# EAGLE design RC_Transmitter_RX_FINAL_v4.4 (EAGLE 9.7.0)
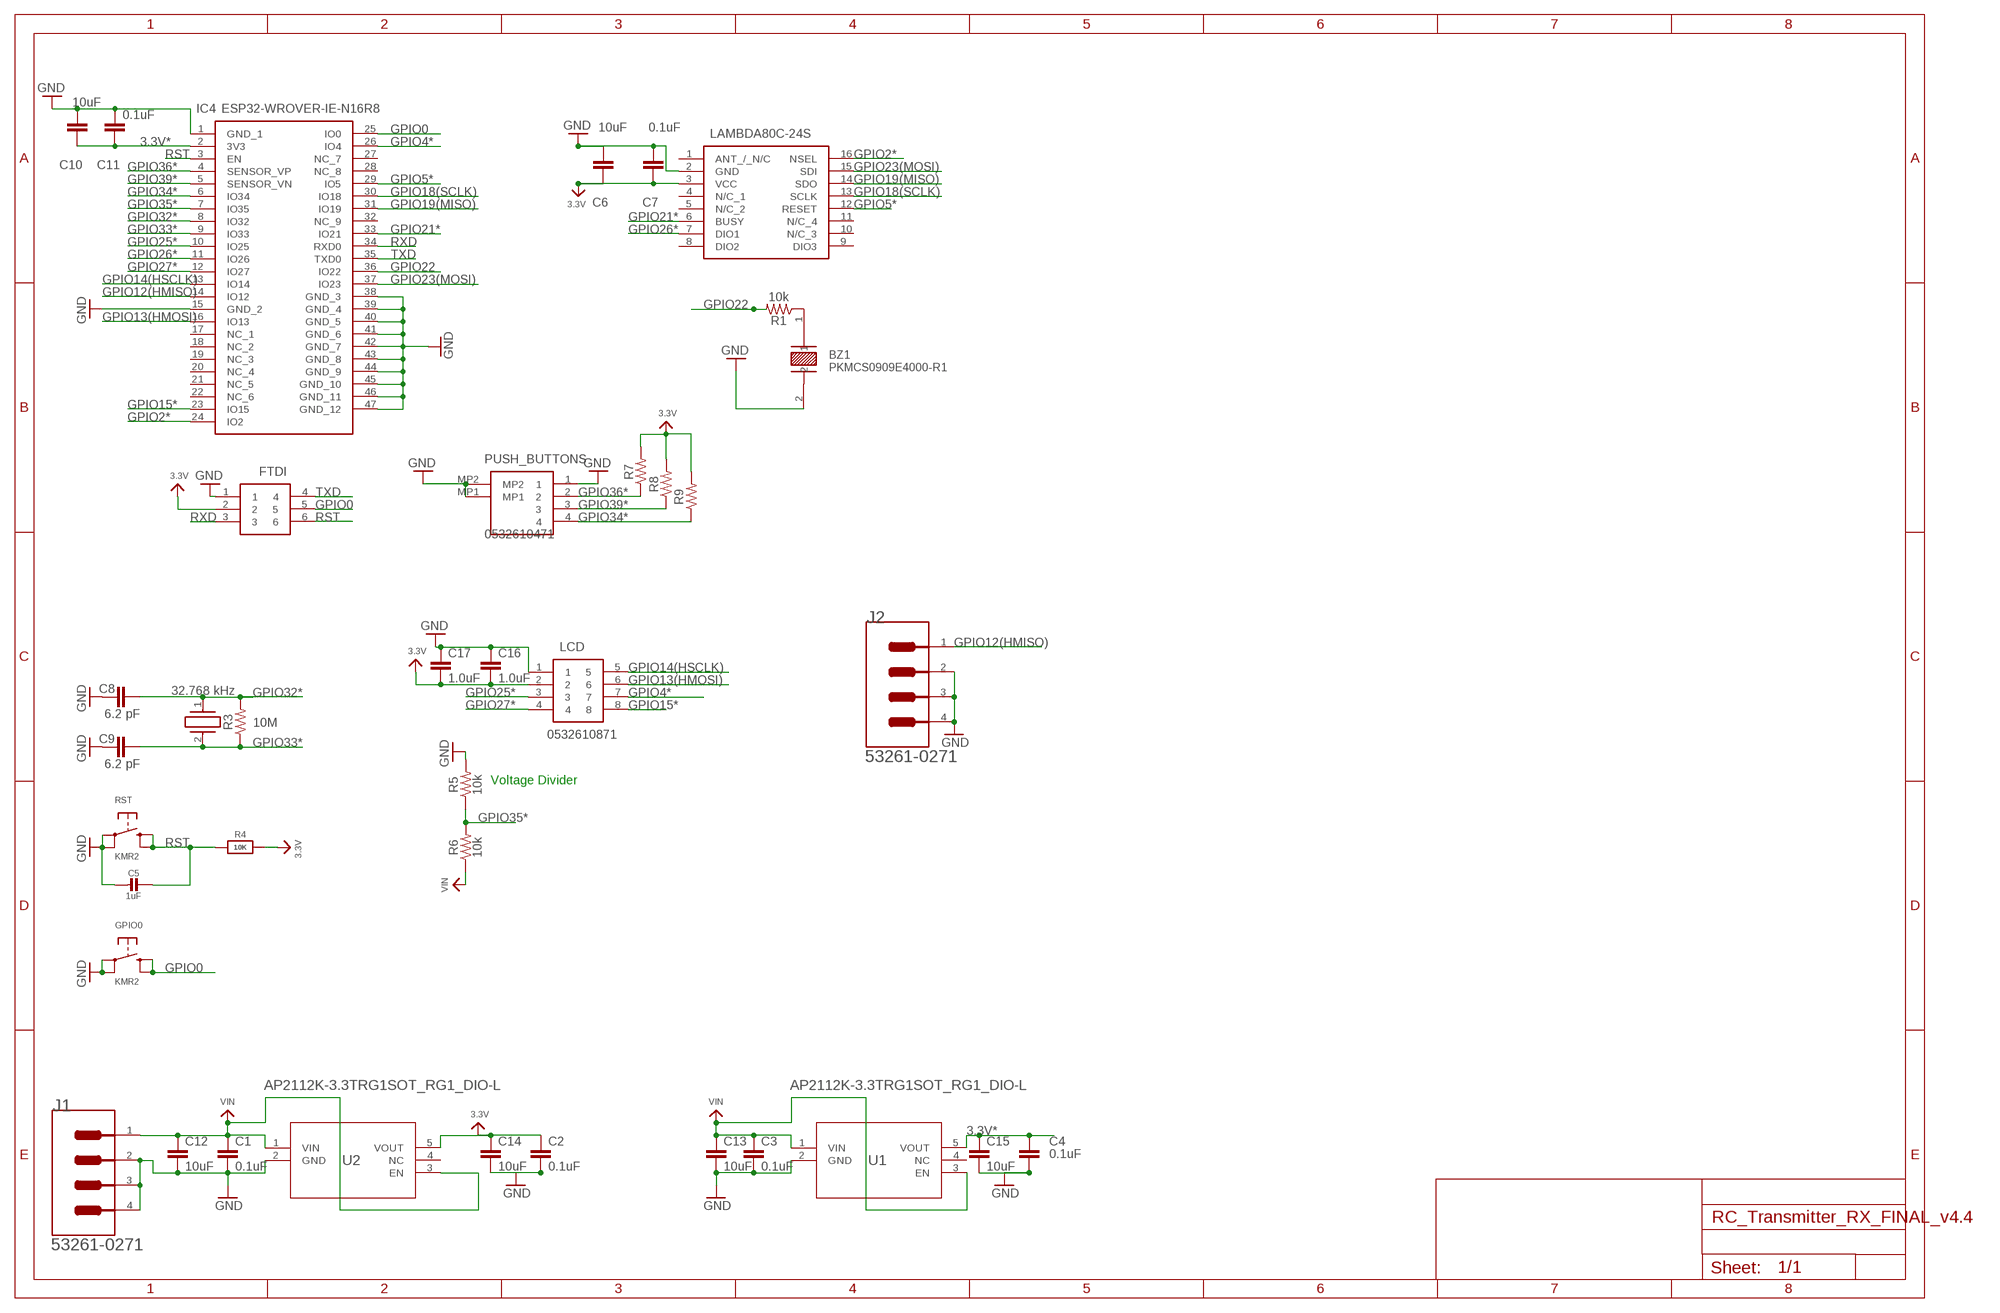
[diagram p0: schematic, sheet 1]

## Parts
BZ1  PKMCS0909E4000-R1  [PKMCS0909E4000-R1]
C1  0.1uF  10UF-0805-10V-10%  [0805]
C2  0.1uF  10UF-0805-10V-10%  [0805]
C3  0.1uF  10UF-0805-10V-10%  [0805]
C4  0.1uF  10UF-0805-10V-10%  [0805]
C5  1uF  CAP_CERAMIC0805-NOOUTLINE  [0805-NO]
C6  10uF  10UF-0805-10V-10%  [0805]
C7  0.1uF  10UF-0805-10V-10%  [0805]
C8  6.2 pF  C_CHIP-0805(2012-METRIC)  [CAPC2012X110]
C9  6.2 pF  C_CHIP-0805(2012-METRIC)  [CAPC2012X110]
C10  10uF  10UF-0805-10V-10%  [0805]
C11  0.1uF  10UF-0805-10V-10%  [0805]
C12  10uF  10UF-0805-10V-10%  [0805]
C13  10uF  10UF-0805-10V-10%  [0805]
C14  10uF  10UF-0805-10V-10%  [0805]
C15  10uF  10UF-0805-10V-10%  [0805]
C16  1.0uF  10UF-0805-10V-10%  [0805]
C17  1.0uF  10UF-0805-10V-10%  [0805]
CRYSTAL  32.768 kHz  ECX-.327-CDX-1293  [ECX327CDX1293]
FTDI  0532610671  [0532610671]
GPIO0  KMR2  SWITCH_TACT_SMT4.6X2.8  [BTN_KMR2_4.6X2.8]
IC1  LAMBDA80C-24S  [LAMBDA80C24S]
IC4  ESP32-WROVER-IE-N16R8  [ESP32WROVERIEN16R8]
J1  MOLEX_53261-0271MOLEX_53261-0271_0_0  [MOLEX_53261-0271_0]
J2  MOLEX_53261-0271MOLEX_53261-0271_0_0  [MOLEX_53261-0271_0]
LCD  0532610871  [53261-0871]
PUSH_BUTTONS  0532610471  [0532610471]
R1  10k  0OHM-0603-1/10W-5%  [0603]
R3  10M  0OHM-0603-1/10W-5%  [0603]
R4  10K  RESISTOR_0805  [_0805]
R5  10k  0OHM-0603-1/10W-5%  [0603]
R6  10k  0OHM-0603-1/10W-5%  [0603]
R7  0  0OHM-0603-1/10W-5%  [0603]
R8  0  0OHM-0603-1/10W-5%  [0603]
R9  0  0OHM-0603-1/10W-5%  [0603]
RST  KMR2  SWITCH_TACT_SMT4.6X2.8  [BTN_KMR2_4.6X2.8]
U1  AP2112K-3.3TRG1SOT_RG1_DIO-L  [SOT_RG1_DIO-L]
U2  AP2112K-3.3TRG1SOT_RG1_DIO-L  [SOT_RG1_DIO-L]

## Nets
3.3V: C2.1 C6.1 C7.1 C14.1 C16.2 C17.2 FTDI.2 IC1.3(VCC) LCD.2 R4.2 R7.2 R8.2 R9.2 U2.5(VOUT)
3.3V*: C4.1 C10.1 C11.1 C15.1 IC4.2(3V3) U1.5(VOUT)
GND: BZ1.2 C1.2 C2.2 C3.2 C4.2 C5.2 C6.2 C7.2 C8.1 C9.1 C10.2 C11.2 C12.2 C13.2 C14.2 C15.2 C16.1 C17.1 FTDI.1 GPIO0.A'(P1) GPIO0.A(P) IC1.2(GND) IC4.1(GND_1) IC4.15(GND_2) IC4.38(GND_3) IC4.39(GND_4) IC4.40(GND_5) IC4.41(GND_6) IC4.42(GND_7) IC4.43(GND_8) IC4.44(GND_9) IC4.45(GND_10) IC4.46(GND_11) IC4.47(GND_12) J1.2 J1.3(MNT_1) J1.4(MNT_2) J2.2 J2.3(MNT_1) J2.4(MNT_2) LCD.1 PUSH_BUTTONS.1 PUSH_BUTTONS.MP1 PUSH_BUTTONS.MP2 R5.2 RST.A'(P1) RST.A(P) U1.2(GND) U2.2(GND)
GPIO0: FTDI.5 GPIO0.B'(S1) GPIO0.B(S) IC4.25(IO0)
GPIO2*: IC1.16(NSEL) IC4.24(IO2)
GPIO4*: IC4.26(IO4) LCD.7
GPIO5*: IC1.12(RESET) IC4.29(IO5)
GPIO12(HMISO): IC4.14(IO12) J2.1
GPIO13(HMOSI): IC4.16(IO13) LCD.6
GPIO14(HSCLK): IC4.13(IO14) LCD.5
GPIO15*: IC4.23(IO15) LCD.8
GPIO18(SCLK): IC1.13(SCLK) IC4.30(IO18)
GPIO19(MISO): IC1.14(SDO) IC4.31(IO19)
GPIO21*: IC1.6(BUSY) IC4.33(IO21)
GPIO22: IC4.36(IO22) R1.2
GPIO23(MOSI): IC1.15(SDI) IC4.37(IO23)
GPIO25*: IC4.10(IO25) LCD.3
GPIO26*: IC1.7(DIO1) IC4.11(IO26)
GPIO27*: IC4.12(IO27) LCD.4
GPIO32*: C8.2 CRYSTAL.1(X1) IC4.8(IO32) R3.2
GPIO33*: C9.2 CRYSTAL.2(X2) IC4.9(IO33) R3.1
GPIO34*: IC4.6(IO34) PUSH_BUTTONS.4 R9.1
GPIO35*: IC4.7(IO35) R5.1 R6.2
GPIO36*: IC4.4(SENSOR_VP) PUSH_BUTTONS.2 R7.1
GPIO39*: IC4.5(SENSOR_VN) PUSH_BUTTONS.3 R8.1
N$1: BZ1.1 R1.1
RST: C5.1 FTDI.6 IC4.3(EN) R4.1 RST.B'(S1) RST.B(S)
RXD: FTDI.3 IC4.34(RXD0)
TXD: FTDI.4 IC4.35(TXD0)
VIN: C1.1 C3.1 C12.1 C13.1 J1.1 R6.1 U1.1(VIN) U1.3(EN) U2.1(VIN) U2.3(EN)
Unconnected: IC1.1(ANT_/_N/C) IC1.4(N/C_1) IC1.5(N/C_2) IC1.8(DIO2) IC1.9(DIO3) IC1.10(N/C_3) IC1.11(N/C_4) IC4.17(NC_1) IC4.18(NC_2) IC4.19(NC_3) IC4.20(NC_4) IC4.21(NC_5) IC4.22(NC_6) IC4.27(NC_7) IC4.28(NC_8) IC4.32(NC_9) U1.4(NC) U2.4(NC)

## Notes on the sheet
- Voltage Divider

## Library data of the parts
BZ1 = Microphone:PKMCS0909E4000-R1: AUDIO PIEZO TRANSDUCER 12.5V SMD Manufacturer's datasheet <https://www.murata.com/~/media/webrenewal/products/sound/sounder/vppt-buzj083-d.ashx>; CREATED_BY: PCBLayout.com; DIGIKEY_PARTNO: 490-9647-2-ND; MANUFACTURER: Murata Electronics; MPN: PKMCS0909E4000-R1
C1-C4 C7 C11 C16 C17 = SparkFun-Capacitors:10UF: 10.0µF ceramic capacitors A capacitor is a passive two-terminal electrical component used to store electrical energy temporarily in an electric field.; PROD_ID: CAP-11330; VALUE: 10uF
C5 = microbuilder:CAP_CERAMIC: Ceramic Capacitors For new designs, use the packages preceded by an '_' character since they are more reliable: The following footprints should be used on most boards: _0402 - Standard footprint for regular board layouts _0603 - Standard footprint for regular board layouts _0805 - Standard footprint for regular board layouts _1206 - Standard footprint for regular board layouts For extremely tight-pitch boards where space is at a premium, the following 'micro-pitch' footprints can be used (smaller pads, no silkscreen outline, etc.): _0402MP - Micro-pitch footprint for very dense/compact boards _0603MP - Micro-pitch footprint for very dense/compact boards _0805MP - Micro-pitch footprint for very dense/compact boards _1206MP - Micro-pitch footprint for very dense/compact boards
C6 C10 C12-C15 = SparkFun-Capacitors:10UF: 10.0µF ceramic capacitors A capacitor is a passive two-terminal electrical component used to store electrical energy temporarily in an electric field.; PROD_ID: CAP-11330
C8 C9 = Capacitor:C: Capacitor - Generic; CATEGORY: Capacitor
CRYSTAL = ECX-.327-CDX-1293:ECX-.327-CDX-1293: Crystals 32.786kHz 12.5pF 5ppm -40C +85C Source: Datasheet <https://www.ecsxtal.com/store/pdf/ECS-.327-CDX-1293.pdf>; ARROW_PART_NUMBER: Crystal; ARROW_PRICE-STOCK: https://www.arrow.com/en/products/ecx-.327-cdx-1293/ecs-international?region=nac; DESCRIPTION: Crystals 32.786kHz 12.5pF 5ppm -40C +85C; HEIGHT: 0.9mm; MANUFACTURER_NAME: ECS; MANUFACTURER_PART_NUMBER: ECX-.327-CDX-1293; MOUSER_PART_NUMBER: 520-ECX-.327CDX-1293; MOUSER_PRICE-STOCK: https://www.mouser.co.uk/ProductDetail/ECS/ECX-.327-CDX-1293?qs=Mv7BduZupUhhIpiFqP8JVA%3D%3D
FTDI = 0532610671:0532610671: 1.25mm Pitch PicoBlade Header, Surface Mount, Right Angle, 6 Circuits Source: Datasheet <http://www.molex.com/webdocs/datasheets/pdf/en-us//0532610671_PCB_HEADERS.pdf>; ARROW_PART_NUMBER: 0532610671; ARROW_PRICE-STOCK: https://www.arrow.com/en/products/0532610671/molex?region=europe; DESCRIPTION: 1.25mm Pitch PicoBlade Header, Surface Mount, Right Angle, 6 Circuits; HEIGHT: mm; MANUFACTURER_NAME: Molex; MANUFACTURER_PART_NUMBER: 0532610671; MOUSER_PART_NUMBER: N/A; MOUSER_PRICE-STOCK: https://www.mouser.co.uk/ProductDetail/Molex/0532610671?qs=PBcRNPEHKspfA5Wux0sJoA%3D%3D
GPIO0 RST = microbuilder:SWITCH_TACT_SMT: SMT Tact Switches 6x6mm - Digikey: P12940SCT-ND KMR2 (4.6x2.8mm) - Digikey: 401-1426-1-ND EVQ-PQHB55 - Light Touch, 160GF (4.5x4.5mm) - Digikey: P8090SCT-ND KMT0 - KMT021 NGJ LHS (etc.) IP68/Waterproof - Digikey: CKN10289CT-ND
IC1 = LAMBDA80C-24S:LAMBDA80C-24S: RF Transceiver FSK 3.3V 16-Pin SMD Module Source: Datasheet <https://www.arrow.com/en/products/lambda80c-24s/rf-solutions>; ARROW_PART_NUMBER: LAMBDA80C-24S; ARROW_PRICE-STOCK: https://www.arrow.com/en/products/lambda80c-24s/rf-solutions; DESCRIPTION: RF Transceiver FSK 3.3V 16-Pin SMD Module; HEIGHT: 2mm; MANUFACTURER_NAME: RF SOLUTIONS; MANUFACTURER_PART_NUMBER: LAMBDA80C-24S; MOUSER_PART_NUMBER: 223-LAMBDA80C-24S; MOUSER_PRICE-STOCK: https://www.mouser.co.uk/ProductDetail/RF-Solutions/LAMBDA80C-24S?qs=17u8i%2FzlE89dhjIrlJ9FHg%3D%3D
IC4 = ESP32-Wrover-IE-N16R8:ESP32-WROVER-IE-N16R8: RX TXRX MOD WIFI EXT IPEX SMD Source: Datasheet <https://www.espressif.com/sites/default/files/documentation/esp32-wrover-e_esp32-wrover-ie_datasheet_en.pdf>; DESCRIPTION: RX TXRX MOD WIFI EXT IPEX SMD; HEIGHT: 3.45mm; MANUFACTURER_NAME: Espressif Systems; MANUFACTURER_PART_NUMBER: ESP32-Wrover-IE-N16R8; MOUSER_PART_NUMBER: 356-ESP32WRVIE2864UC; MOUSER_PRICE-STOCK: https://www.mouser.co.uk/ProductDetail/Espressif-Systems/ESP32-WROVER-IE-N16R8?qs=Li%252BoUPsLEnvfUqsrs3zskw%3D%3D
J1 J2 = Molex - 53261-0271:MOLEX_53261-0271: Headers & Wire Housings 1.25MM HDR 2 CKT Right-Angle; CENTROID_NOT_SPECIFIED: No; DATASHEET: http://www.molex.com/pdm_docs/sd/532610271_sd.pdf; DIGIKEY_DESCRIPTION: CONN HEADER 2POS 1.25MM R/A SMD; DIGIKEY_PART_NUMBER: WM7620CT-ND; LEAD_FREE: yes; MF: Molex; MOUSER_PART_NUMBER: 538-53261-0271; MPN: 53261-0271; PACKAGE: HDR02; PREFIX: J; ROHS: yes; TEMPERATURE_RANGE_HIGH: +85°C; TEMPERATURE_RANGE_LOW: -40°C
LCD = 0532610871:0532610871: CONN HEADER 8POS 1.25MM R/A SMD Source: Datasheet <https://www.molex.com/pdm_docs/sd/532610871_sd.pdf>; ARROW_PART_NUMBER: 0532610871; ARROW_PRICE-STOCK: https://www.arrow.com/en/products/0532610871/molex?region=europe; DESCRIPTION: CONN HEADER 8POS 1.25MM R/A SMD; HEIGHT: mm; MANUFACTURER_NAME: Molex; MANUFACTURER_PART_NUMBER: 0532610871; MOUSER_PART_NUMBER: N/A; MOUSER_PRICE-STOCK: https://www.mouser.co.uk/ProductDetail/Molex/0532610871?qs=PBcRNPEHKspgmg1Yw%252BK1hQ%3D%3D
PUSH_BUTTONS = 0532610471:0532610471: Headers & Wire Housings 1.25MM HDR 04P RA SMT Source: Datasheet <https://www.molex.com/pdm_docs/sd/532610471_sd.pdf>; ARROW_PART_NUMBER: 0532610471; ARROW_PRICE-STOCK: https://www.arrow.com/en/products/0532610471/molex?region=nac; DESCRIPTION: Headers & Wire Housings 1.25MM HDR 04P RA SMT; HEIGHT: 3.6mm; MANUFACTURER_NAME: Molex; MANUFACTURER_PART_NUMBER: 0532610471; MOUSER_PART_NUMBER: N/A; MOUSER_PRICE-STOCK: https://www.mouser.co.uk/ProductDetail/Molex/0532610471?qs=PBcRNPEHKsrtKT62ep6ONg%3D%3D
R1 R3 R5 R6 = SparkFun-Resistors:0OHM: 0Ω resistor A resistor is a passive two-terminal electrical component that implements electrical resistance as a circuit element. Resistors act to reduce current flow, and, at the same time, act to lower voltage levels within circuits. - Wikipedia; PROD_ID: RES-08609; VALUE: 0
R4 = microbuilder:RESISTOR: Resistors For new designs, use the packages preceded by an '_' character since they are more reliable: The following footprints should be used on most boards: _0402 - Standard footprint for regular board layouts _0603 - Standard footprint for regular board layouts _0805 - Standard footprint for regular board layouts _1206 - Standard footprint for regular board layouts For extremely tight-pitch boards where space is at a premium, the following 'micro-pitch' footprints can be used (smaller pads, no silkscreen outline, etc.): _0402MP - Micro-pitch footprint for very dense/compact boards _0603MP - Micro-pitch footprint for very dense/compact boards _0805MP - Micro-pitch footprint for very dense/compact boards _1206MP - Micro-pitch footprint for very dense/compact boards
R7-R9 = SparkFun-Resistors:0OHM: 0Ω resistor A resistor is a passive two-terminal electrical component that implements electrical resistance as a circuit element. Resistors act to reduce current flow, and, at the same time, act to lower voltage levels within circuits. - Wikipedia; PROD_ID: RES-08609
U1 U2 = 2023-03-07_19-05-44_Library:AP2112K-3.3TRG1; COPYRIGHT: Copyright (C) 2023 Ultra Librarian. All rights reserved.; MANUFACTURER_PART_NUMBER: AP2112K-3.3TRG1; MFR_NAME: Diodes Inc

## Board
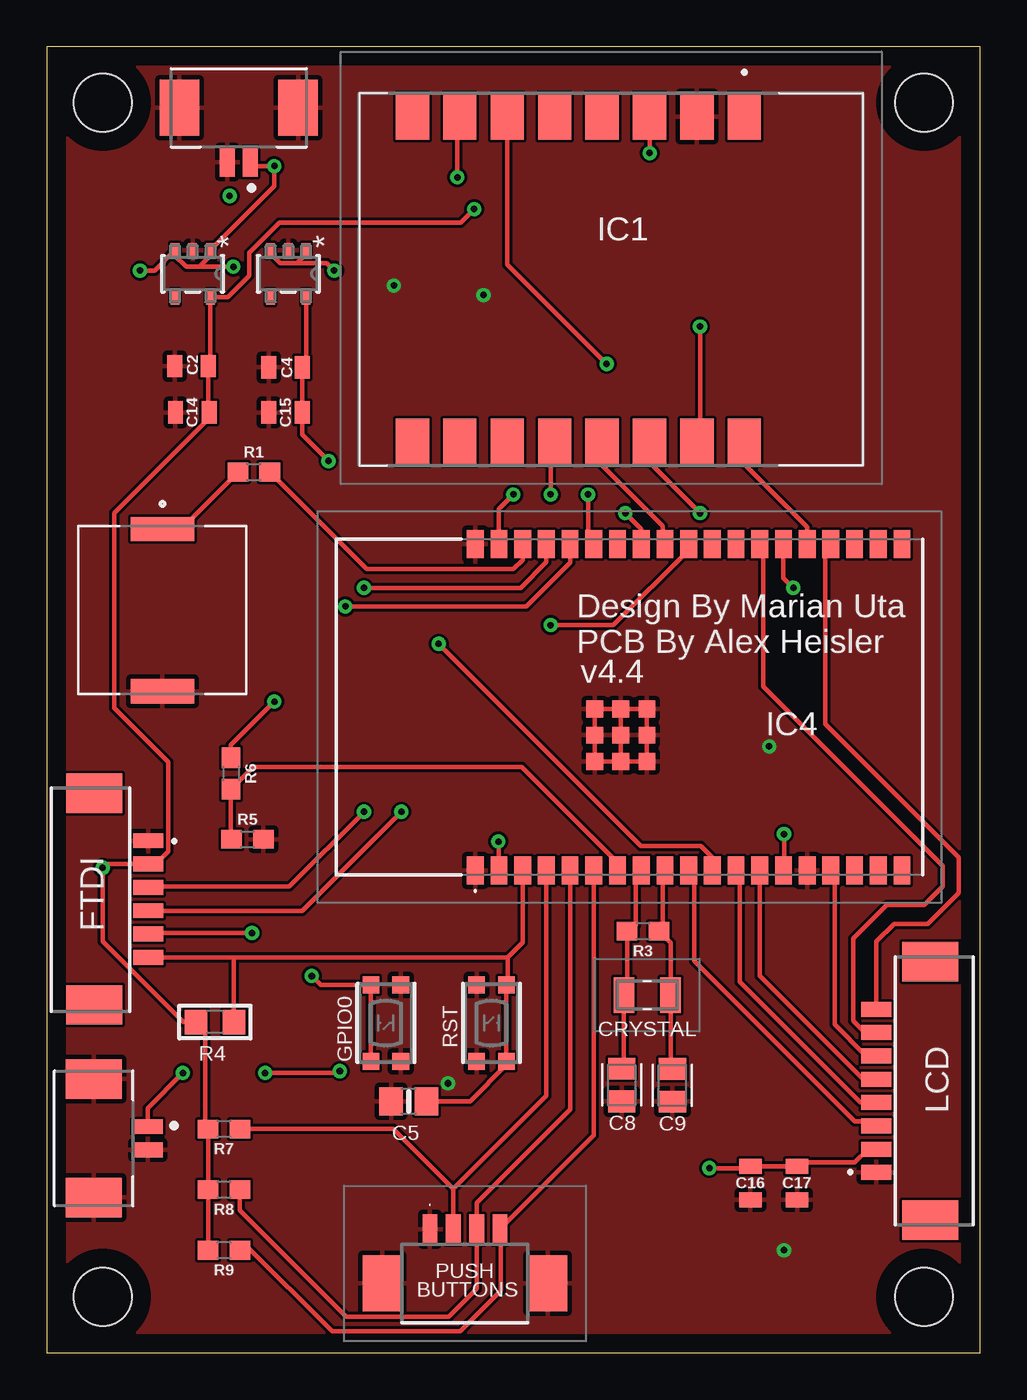
[diagram p1: board, top side]
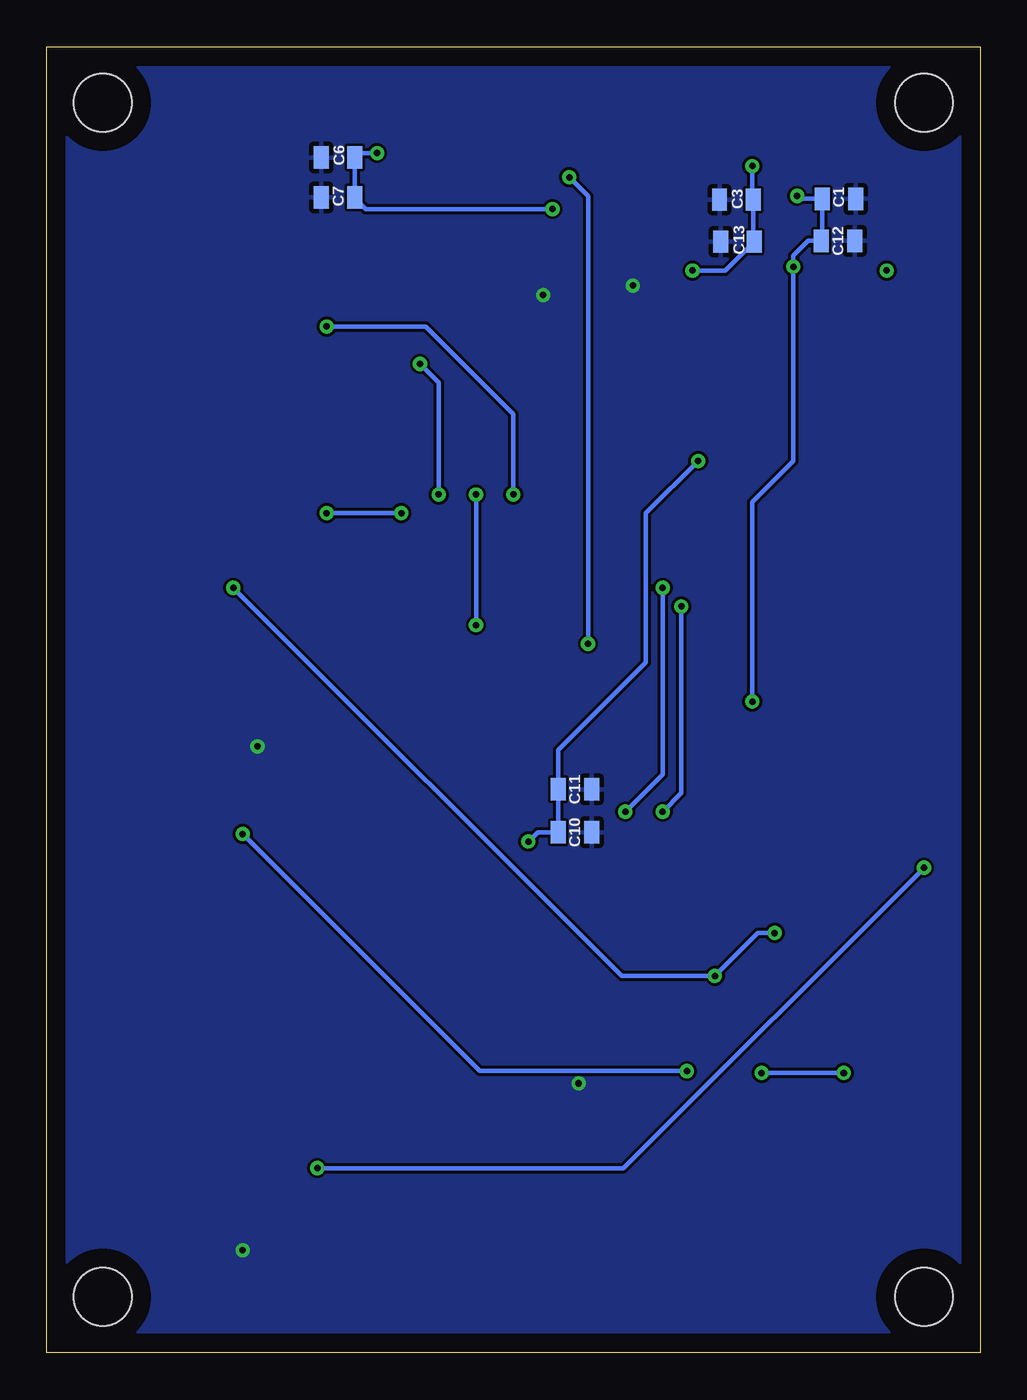
[diagram p2: board, bottom side, seen from below]

Size 50 x 70 mm. Coordinates in mm from the lower left corner, seen from the top.
Outline: 0,0 50,0 50,70 0,70 0,0
Copper layers (1*16): Top 0.035mm / dielectric 1.5mm / Bottom 0.035mm
Design rules "default": minimum track width 6mil, minimum drill 0.35mm, track to track 6mil, track to pad 6mil, pad to pad 6mil, via to via 6mil, smd to smd 6mil, copper to edge 40mil, drill to drill 6mil, minimum pad ring 10mil, minimum via ring 8mil, stop-mask expansion 4mil, vias tented up to drill 0mil, thermal gap 10mil
Holes 3.1 mm at 3,3 47,3 47,67 3,67

### Footprints (pad centres in the part's own frame; a part is rotated, then mirrored left to right if it is on the bottom)
PKMCS0909E4000-R1 = smd 1.3 x 3.4: 1 -4.35,0; 2 4.35,0
0805 = smd 0.8 x 1.2: 1 -0.9,0; 2 0.9,0
0805-NO = smd 1.24 x 1.5: 1 -0.95,0; 2 0.95,0
CAPC2012X110 = smd 1.165 x 1.465: 1 -0.875,0; 2 0.875,0
ECX327CDX1293 = smd 1.1 x 1.9: 1 -1.25,0; 2 1.25,0
0532610671 = smd 0.8 x 1.6: 1 -3.125,1.004; 2 -1.875,1.004; 3 -0.625,1.004; 4 0.625,1.004; 5 1.875,1.004; 6 3.125,1.004 | smd 2.1 x 3: 7 -5.675,-1.896; 8 5.675,-1.896
BTN_KMR2_4.6X2.8 = smd 0.9 x 0.9: A 2.05,0.8; A' -2.05,0.8; B 2.05,-0.8; B' -2.05,-0.8
LAMBDA80C24S = smd 2.5 x 1.78: 1 -8.725,7.135; 2 -8.725,4.595; 3 -8.725,2.055; 4 -8.725,-0.485; 5 -8.725,-3.025; 6 -8.725,-5.565; 7 -8.725,-8.105; 8 -8.725,-10.645; 9 8.725,-10.645; 10 8.725,-8.105; 11 8.725,-5.565; 12 8.725,-3.025; 13 8.725,-0.485; 14 8.725,2.055; 15 8.725,4.595; 16 8.725,7.135
ESP32WROVERIEN16R8 = smd 1.5 x 0.9: 1 -8.75,8.26; 2 -8.75,6.99; 3 -8.75,5.72; 4 -8.75,4.45; 5 -8.75,3.18; 6 -8.75,1.91; 7 -8.75,0.64; 8 -8.75,-0.63; 9 -8.75,-1.9; 10 -8.75,-3.17; 11 -8.75,-4.44; 12 -8.75,-5.71; 13 -8.75,-6.98; 14 -8.75,-8.25; 15 -8.75,-9.52; 16 -8.75,-10.79; 17 -8.75,-12.06; 18 -8.75,-13.33; 19 -8.75,-14.6; 20 8.75,-14.6; 21 8.75,-13.33; 22 8.75,-12.06; 23 8.75,-10.79; 24 8.75,-9.52; 25 8.75,-8.25; 26 8.75,-6.98; 27 8.75,-5.71; 28 8.75,-4.44; 29 8.75,-3.17; 30 8.75,-1.9; 31 8.75,-0.63; 32 8.75,0.64; 33 8.75,1.91; 34 8.75,3.18; 35 8.75,4.45; 36 8.75,5.72; 37 8.75,6.99; 38 8.75,8.26 | smd 0.9 x 0.9: 39 -1.5,0.46; 40 -1.5,1.86; 41 -2.9,1.86; 42 -2.9,0.46; 43 -2.9,-0.94; 44 -1.5,-0.94; 45 -0.1,-0.94; 46 -0.1,0.46; 47 -0.1,1.86
MOLEX_53261-0271_0 = smd 0.8 x 1.6: 1 -0.625,2.9; 2 0.625,2.9 | smd 2.1 x 3: 3 -3.175,0; 4 3.175,0
53261-0871 = smd 0.8 x 1.6: 1 -4.375,1.004; 2 -3.125,1.004; 3 -1.875,1.004; 4 -0.625,1.004; 5 0.625,1.004; 6 1.875,1.004; 7 3.125,1.004; 8 4.375,1.004 | smd 2.1 x 3: 9 6.925,-1.896; 10 -6.925,-1.896
0532610471 = smd 0.8 x 1.6: 1 -1.875,0.8; 2 -0.625,0.8; 3 0.625,0.8; 4 1.875,0.8 | smd 2.1 x 3: MP1 4.425,-2.1; MP2 -4.425,-2.1
0603 = smd 1.1 x 1: 1 -0.85,0; 2 0.85,0
_0805 = smd 1.2 x 1.3: 1 -1.016,0; 2 1.016,0
SOT_RG1_DIO-L = smd 0.8 x 0.457: 1 -1.251,0.95; 2 -1.251,0; 3 -1.251,-0.95; 4 1.251,-0.95; 5 1.251,0.95

### Placement (x,y rotation side)
BZ1  6.2,39.8 270 top
C1  7.54,61.84 0 bottom
C2  7.76,52.88 180 top
C3  13.05,61.8 180 bottom
C4  12.8,52.82 180 top
C5  19.4,13.48 180 top
C6  34.39,64.06 180 bottom
C7  34.4,61.92 180 bottom
C8  30.8,14.35 90 top
C9  33.52,14.35 90 top
C10  21.7,27.9 0 bottom
C11  21.7,30.2 0 bottom
C12  7.6,59.6 0 bottom
C13  13,59.55 180 bottom
C14  7.8,50.4 180 top
C15  12.8,50.4 180 top
C16  37.7,9.1 90 top
C17  40.2,9.1 90 top
CRYSTAL  32.17,19.17 0 top
FTDI  4.44,24.32 270 top
GPIO0  18.17,17.68 270 top
IC1  30.24,57.53 270 top
IC4  31.22,34.6 90 top
J1  10.29,66.72 180 top
J2  2.52,11.5 270 top
LCD  45.45,14.04 90 top
PUSH_BUTTONS  22.41,5.82 0 top
R1  11.1,47.2 0 top
R3  31.95,22.6 180 top
R4  9.01,17.73 180 top
R5  10.76,27.52 0 top
R6  9.87,31.05 270 top
R7  9.5,12 180 top
R8  9.5,8.75 180 top
R9  9.5,5.5 180 top
RST  23.83,17.68 90 top
U1  12.95,57.83 270 top
U2  7.82,57.83 270 top

### Tracks (layer width: path | path; a pad name or v marks a point on that pad's centre or on a via)
3.3V  (via drill 0.35)
  Top 0.254: LCD.2 44.02,10.91 43.3,10.2 40.4,10.2 C17.2 C16.2 37.6,9.9 v35.5,9.9 | R9.2 R8.2 R7.2 8.49,12.16 8.49,17.23 R4.2 7.31,17.73 3,22.04 v3,26 3.19,26.2 FTDI.2 5.84,26.2 6.52,26.87 6.52,31.65 3.62,34.55 3.62,45.02 8.7,50.09 C14.1 8.66,50.44 C2.1 8.77,52.99 U2.5 9.71,56.58 10.86,57.73 10.86,58.96 12.46,60.56 22.18,60.56 22.9,61.28 v22.9,61.3 | IC1.3 v32.3,64.31 v32.3,64.3
  Bottom 0.254: v3,26 19.1,9.9 v35.5,9.9 | v32.3,64.3 33.25,64.3 C6.1 C7.1 33.52,61.92 32.9,61.3 v22.9,61.3
3.3V*  (via drill 0.35)
  Top 0.254: IC4.2 24.23,27.37 v24.2,27.4 | U1.5 13.9,53.02 C4.1 C15.1 13.7,49.2 v15.1,47.8
  Bottom 0.254: v24.2,27.4 23.7,27.9 C10.1 C11.1 22.6,32.3 17.9,37 17.9,45 v15.1,47.8
GND  (via drill 0.35)
  Top 0.254: IC4.46 IC4.47 IC4.40 IC4.41 IC4.42 | IC4.46 IC4.45 IC4.44 IC4.43 IC4.42 | IC4.42 IC4.39 IC4.46
  other vias: 39.5,5.5 18.6,57.2 23.4,56.68 38.7,32.5 21.5,14.44
  pour Top: 0,0 50,0 50,70 0,70
  pour Bottom: 0,0 50,0 50,70 0,70
GPIO0  (via drill 0.35)
  Top 0.254: IC4.25 39.47,41.53 v40,41 | v14.2,20.2 14.68,19.73 GPIO0.B' GPIO0.B | v11,22.5 5.5,22.5 FTDI.5
  Bottom 0.254: v11,22.5 11.9,22.5 v14.2,20.2 19.2,20.2 v40,41
GPIO2*
  Top 0.254: IC4.24 40.74,44.26 37.38,47.62 IC1.16
GPIO4*
  Top 0.254: LCD.7 44.28,17 44,17 43.2,17.8 43.2,22.2 45,24 47,24 48,25 48,26.1 38.4,35.7 38.4,43.15 IC4.26
GPIO5*  (via drill 0.35)
  Top 0.254: v27,46 27,48.59 IC1.12 | IC4.29 34.39,43.02 30.36,39 v27,39
  Bottom 0.254: v27,39 v27,46
GPIO12(HMISO)  (via drill 0.35)
  Top 0.254: v7.3,15 5.42,13.12 J2.1 | v11.7,15 15.6,15 v15.7,15.1 | IC4.14 39.5,25.88 v39.5,27.8
  Bottom 0.254: v7.3,15 v11.7,15 | v15.7,15.1 26.8,15.1 v39.5,27.8
GPIO13(HMOSI)
  Top 0.254: LCD.6 43.88,15.91 42.21,17.59 42.21,25.65 IC4.16
GPIO14(HSCLK)
  Top 0.254: LCD.5 43.73,14.66 38.2,20.2 IC4.13
GPIO15*
  Top 0.254: LCD.8 44.45,22.05 45.4,23 47.2,23 48.86,24.66 48.86,26.54 41.71,33.69 41.71,43.05 IC4.23
GPIO18(SCLK)
  Top 0.254: IC4.30 33,43.47 33,44.3 29.75,47.55 IC1.13
GPIO19(MISO)  (via drill 0.35)
  Top 0.254: IC4.31 31.85,44.15 v31,45 | IC1.14 32.3,47.7 v35,45
  Bottom 0.254: v31,45 v35,45
GPIO21*  (via drill 0.35)
  Top 0.254: IC4.33 29,43.66 v29,46 | IC1.6 24.68,58.33 v30,53
  Bottom 0.254: v29,46 29,52 v30,53
GPIO22
  Top 0.254: IC4.36 25.5,42.5 25,42 17.15,42 R1.2
GPIO23(MOSI)  (via drill 0.35)
  Top 0.254: IC4.37 24.23,45.23 v25,46 | v35,55 35,48.97 IC1.15
  Bottom 0.254: v25,46 25,50.3 29.7,55 v35,55
GPIO25*
  Top 0.254: LCD.3 44.21,12.4 43.3,12.4 34.69,21.01 34.69,25.55 IC4.10
GPIO26*  (via drill 0.35)
  Top 0.254: v22,63 22,66.12 IC1.7 | IC4.11 35.66,26.54 35.03,27.17 31.83,27.17 v21,38
  Bottom 0.254: v21,38 21,62 v22,63
GPIO27*
  Top 0.254: LCD.4 43.59,13.41 37.13,19.87 37.13,25.65 IC4.12
GPIO32*
  Top 0.254: C8.2 30.92,15.34 CRYSTAL.1 31.1,19.35 R3.2 31.25,22.6 31.55,22.9 31.55,25.55 IC4.8
GPIO33*
  Top 0.254: C9.2 33.42,15.32 CRYSTAL.2 33.42,21.98 R3.1 33,22.8 33,25.73 IC4.9
GPIO34*
  Top 0.254: PUSH_BUTTONS.4 24.33,6.67 | 24.33,6.67 29.31,11.64 IC4.6 | R9.1 10.65,5.8 15.31,1.14 22.14,1.14 24.33,3.33 24.33,6.67
GPIO35*
  Top 0.254: R5.1 9.87,27.56 R6.2 11.07,31.4 25.46,31.4 30.58,26.28 IC4.7
GPIO36*
  Top 0.254: PUSH_BUTTONS.2 21.79,8.79 | IC4.4 26.77,13.77 21.79,8.79 | R7.1 18.57,12 21.79,8.79
GPIO39*
  Top 0.254: IC4.5 28.04,13.04 23.04,8.04 PUSH_BUTTONS.3 23.04,3.44 21.54,1.94 16.06,1.94 10.35,7.65 R8.1
N$1
  Top 0.254: R1.1 7.2,44.15 BZ1.1
RST
  Top 0.254: 10.03,21.2 FTDI.6 | 10.03,21.2 24.7,21.2 | 24.7,21.2 24.7,19.8 RST.B RST.B' 24.63,15.43 22.68,13.48 C5.1 | IC4.3 25.5,22 24.7,21.2 | R4.1 10.03,21.2
RXD  (via drill 0.35)
  Top 0.254: FTDI.3 5.5,25 13,25 v17,29 | v16,40 25.7,40 28.04,42.34 IC4.34
  Bottom 0.254: v17,29 16,30 v16,40
TXD  (via drill 0.35)
  Top 0.254: FTDI.4 13.7,23.7 v19,29 | v17,41 25.4,41 26.77,42.37 IC4.35
  Bottom 0.254: v19,29 17,31 v17,41
VIN  (via drill 0.35)
  Top 0.152: J1.1 10.91,63.7 11.02,63.6
  Top 0.254: v12.2,34.9 9.87,32.57 R6.1 | v5,58 5.79,58 U2.3 6.87,58.81 7.48,58.2 8.16,58.2 | 8.16,58.2 8.71,58.74 8.71,59.02 U2.1 11.34,61.65 12.2,62.51 v12.2,63.6 11.02,63.6 | U1.1 13.9,58.91 13.39,58.4 | 13.39,58.4 12.51,58.4 12,58.91 U1.3 | v10,58.2 8.17,58.2 8.16,58.2 | v15.4,58 15,58.4 13.39,58.4
  Bottom 0.254: v12.2,34.9 12.2,45.6 10,47.8 v10,58.2 10,58.8 9.2,59.6 C12.1 8.45,59.66 C1.1 9.64,61.84 v9.8,62 | v12.2,63.6 12.2,61.84 C3.1 12.15,59.6 C13.1 13.65,58 v15.4,58

### Text on the board
tNames: Design By Marian Uta / PCB By Alex Heisler | v4.4 | PUSH | BUTTONS